# Altium project Battery Monitor V2.PrjPcb
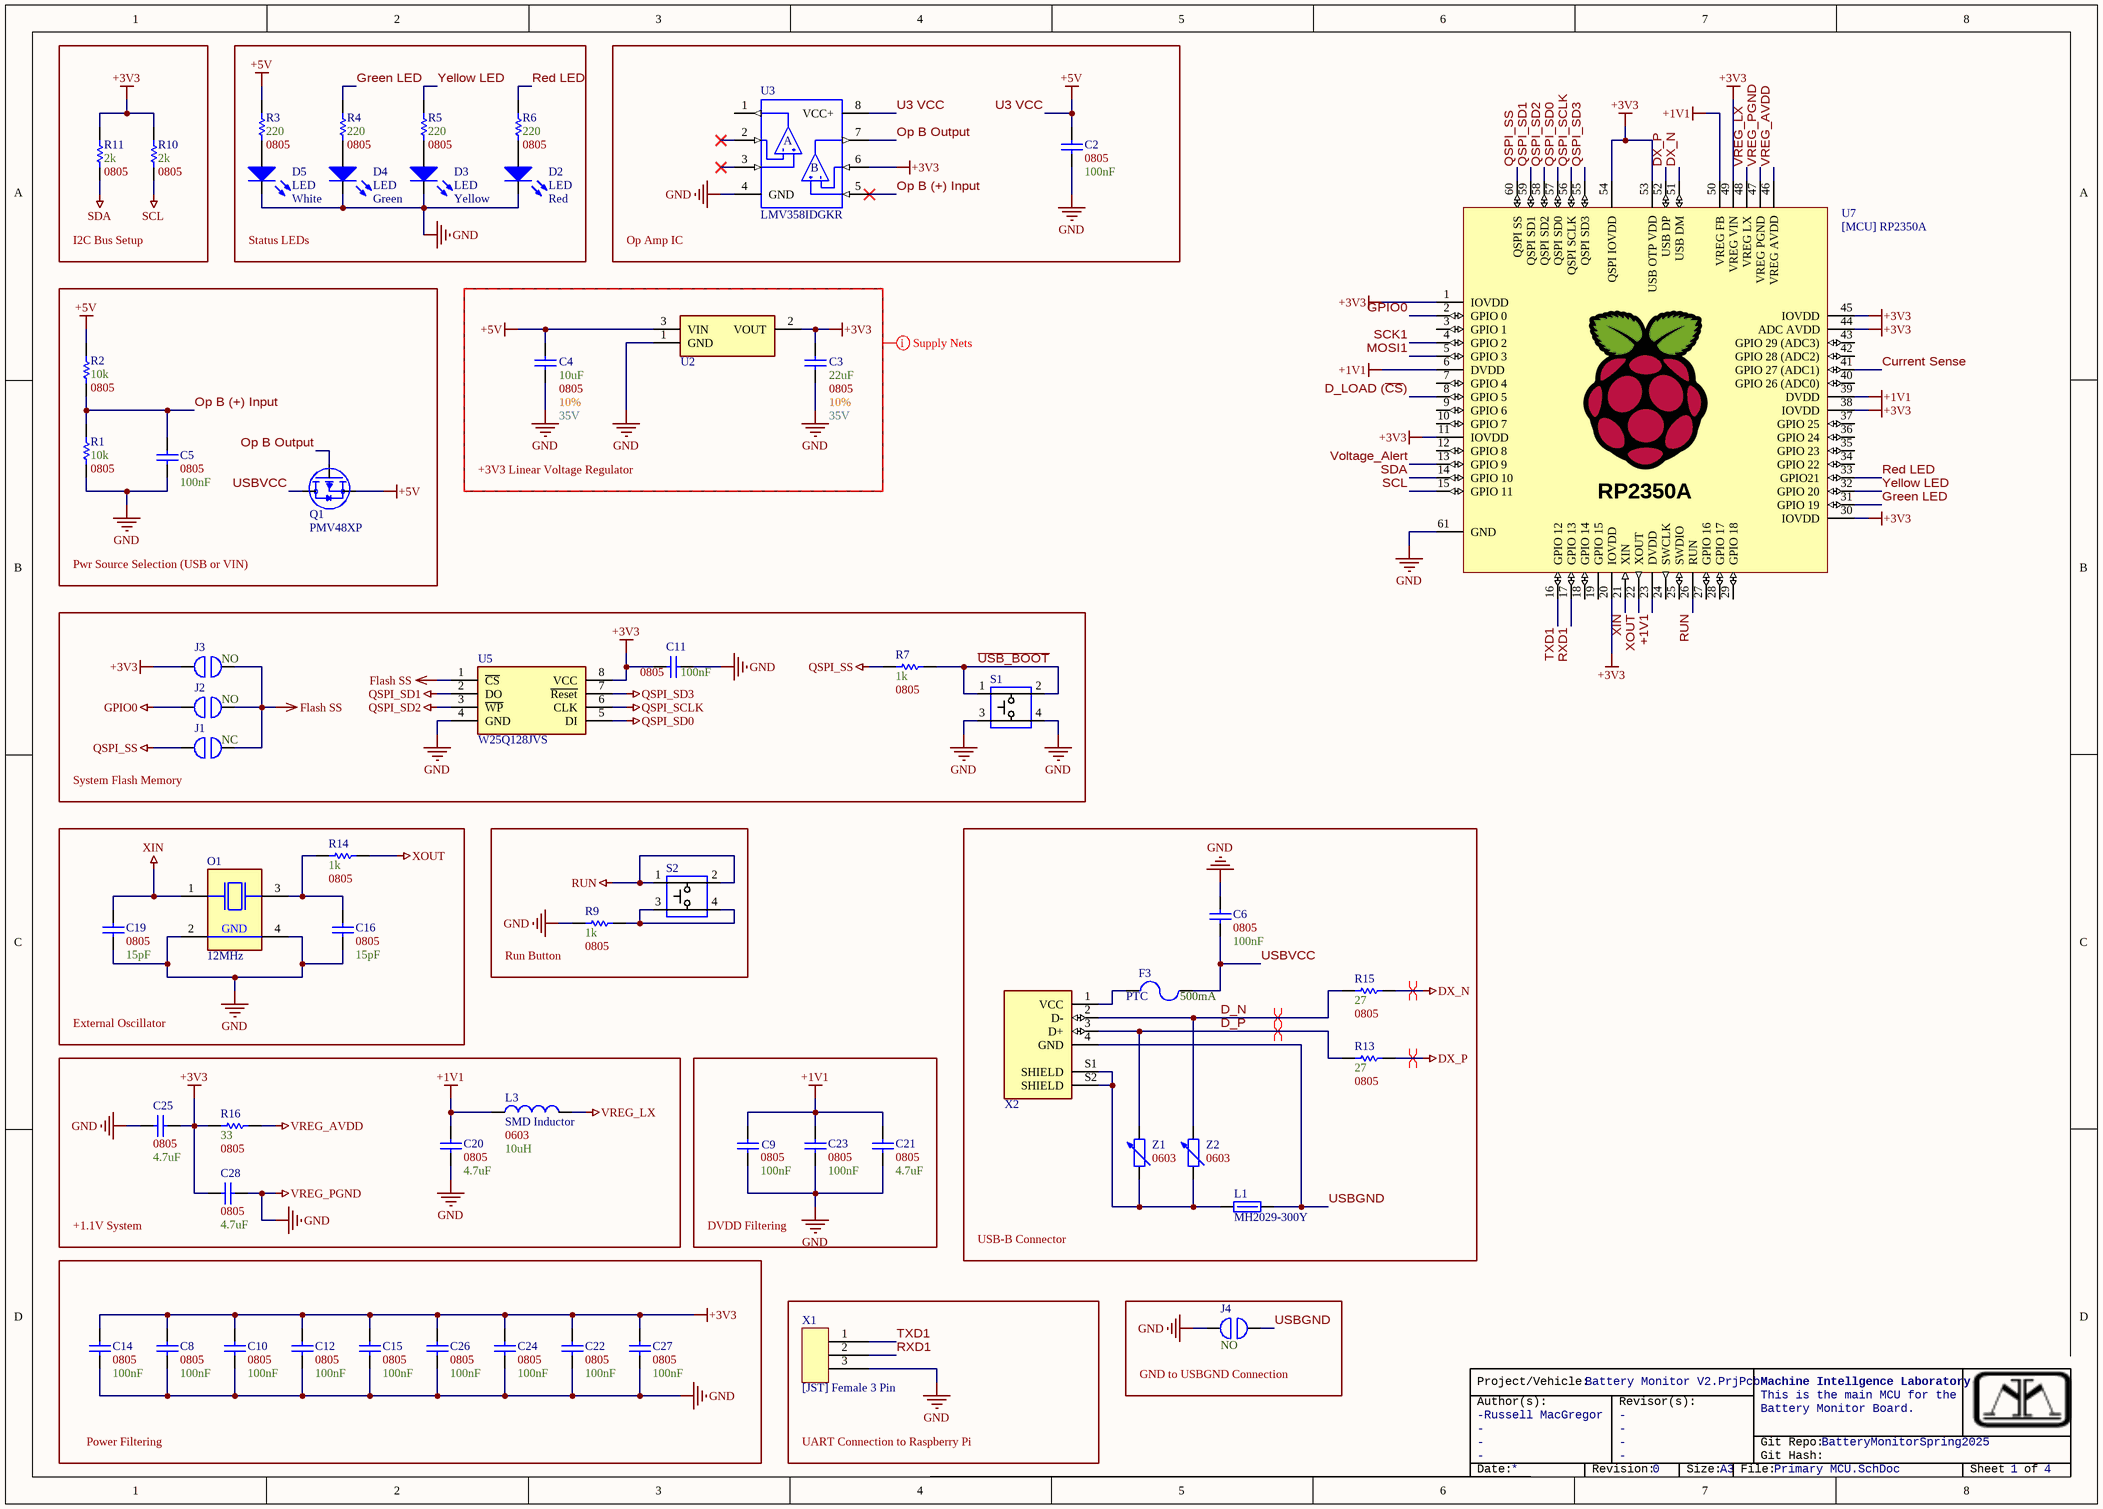
[diagram p0: Primary MCU.SchDoc]
4 sheets, 87 parts. Net scope: global (net labels, ports and power ports of the same name join across sheets).
Board file: main.PcbDoc
Sheets:
  Primary MCU.SchDoc
  Battery Monitoring.SchDoc
  Seven-Seg Displays.SchDoc
  DC Step-Down Converter.SchDoc

## Sheet Primary MCU.SchDoc
size A3; ENG_APP_DATE: --/--/--; DSN_APP_DATE: --/--/--; CHK_APP_DATE: --/--/--; Sheet_Number: 1; Author1: Russell MacGregor; VersionControl_Repository: BatteryMonitorSpring2025; Date: 03/09/2025; Organization: Machine Intellgence Laboratory; Des1: This is the main MCU for the; Des2: Battery Monitor Board.; Revision: 0; SheetNumber: 1; SheetTotal: 4; Time: 12:13 AM

### Parts
C2  Size Package: 0805  Capacitance: 100nF  [[Cap] SMD 0805]  (hidden comment: [Cap] SMD Nonpolarized)
C3  Voltage: 35V  Tolerance: 10%  Size Package: 0805  Capacitance: 22uF  [[Cap] SMD 0805]  (hidden comment: SMD Nonpolarized)
C4  Voltage: 35V  Tolerance: 10%  Size Package: 0805  Capacitance: 10uF  [[Cap] SMD 0805]  (hidden comment: SMD Nonpolarized)
C5  Size Package: 0805  Capacitance: 100nF  [[Cap] SMD 0805]  (hidden comment: [Cap] SMD Nonpolarized)
C6  Size Package: 0805  Capacitance: 100nF  [[Cap] SMD 0805]  (hidden comment: [Cap] SMD Nonpolarized)
C8  Size Package: 0805  Capacitance: 100nF  [[Cap] SMD 0805]  (hidden comment: [Cap] SMD Nonpolarized)
C9  Size Package: 0805  Capacitance: 100nF  [[Cap] SMD 0805]  (hidden comment: [Cap] SMD Nonpolarized)
C10  Size Package: 0805  Capacitance: 100nF  [[Cap] SMD 0805]  (hidden comment: [Cap] SMD Nonpolarized)
C11  Size Package: 0805  Capacitance: 100nF  [[Cap] SMD 0805]  (hidden comment: [Cap] SMD Nonpolarized)
C12  Size Package: 0805  Capacitance: 100nF  [[Cap] SMD 0805]  (hidden comment: [Cap] SMD Nonpolarized)
C14  Size Package: 0805  Capacitance: 100nF  [[Cap] SMD 0805]  (hidden comment: [Cap] SMD Nonpolarized)
C15  Size Package: 0805  Capacitance: 100nF  [[Cap] SMD 0805]  (hidden comment: [Cap] SMD Nonpolarized)
C16  Size Package: 0805  Capacitance: 15pF  [[Cap] SMD 0805]  (hidden comment: [Cap] SMD Nonpolarized)
C19  Size Package: 0805  Capacitance: 15pF  [[Cap] SMD 0805]  (hidden comment: [Cap] SMD Nonpolarized)
C20  Size Package: 0805  Capacitance: 4.7uF  [[Cap] SMD 0805]  (hidden comment: [Cap] SMD Nonpolarized)
C21  Size Package: 0805  Capacitance: 4.7uF  [[Cap] SMD 0805]  (hidden comment: [Cap] SMD Nonpolarized)
C22  Size Package: 0805  Capacitance: 100nF  [[Cap] SMD 0805]  (hidden comment: [Cap] SMD Nonpolarized)
C23  Size Package: 0805  Capacitance: 100nF  [[Cap] SMD 0805]  (hidden comment: [Cap] SMD Nonpolarized)
C24  Size Package: 0805  Capacitance: 100nF  [[Cap] SMD 0805]  (hidden comment: [Cap] SMD Nonpolarized)
C25  Size Package: 0805  Capacitance: 4.7uF  [[Cap] SMD 0805]  (hidden comment: [Cap] SMD Nonpolarized)
C26  Size Package: 0805  Capacitance: 100nF  [[Cap] SMD 0805]  (hidden comment: [Cap] SMD Nonpolarized)
C27  Size Package: 0805  Capacitance: 100nF  [[Cap] SMD 0805]  (hidden comment: [Cap] SMD Nonpolarized)
C28  Size Package: 0805  Capacitance: 4.7uF  [[Cap] SMD 0805]  (hidden comment: [Cap] SMD Nonpolarized)
D2  LED  Color: Red  [[LED] Thru-Hole, 3mm, Red]
D3  LED  Color: Yellow  [[LED] Thru-Hole, 3mm, Yellow]
D4  LED  Color: Green  [[LED] Thru-Hole, 3mm, Green]
D5  LED  Color: White  [[LED] Thru-Hole, 3mm, White]
F3  PTC  Trip Current: 500mA  [[PTC] 500mA Trip]
J1  NO/NC: NC  [[Jumper] Solderable Jumper]  (hidden comment: [Jump] SMD Jumper)
J2  NO/NC: NO  [[Jumper] Solderable Jumper]  (hidden comment: [Jump] SMD Jumper)
J3  NO/NC: NO  [[Jumper] Solderable Jumper]  (hidden comment: [Jump] SMD Jumper)
J4  NO/NC: NO  [[Jumper] Solderable Jumper]  (hidden comment: [Jump] SMD Jumper)
L1  MH2029-300Y  [[Ferrite] SMD Bead 0805 (1)]
L3  SMD Inductor  Size Package: 0603  Inductance: 10uH  [[Inductor] SMD 0603]
O1  12MHz  [[XTAL] SMD 12MHz]
Q1  PMV48XP  [[FET] P-Channel Mosfet]
R1  Resistance: 10k  Size Package: 0805  [[Res] SMD 0805]  (hidden comment: [Res] SMD Resistor)
R2  Resistance: 10k  Size Package: 0805  [[Res] SMD 0805]  (hidden comment: [Res] SMD Resistor)
R3  Resistance: 220  Size Package: 0805  [[Res] SMD 0805]  (hidden comment: [Res] SMD Resistor)
R4  Resistance: 220  Size Package: 0805  [[Res] SMD 0805]  (hidden comment: [Res] SMD Resistor)
R5  Resistance: 220  Size Package: 0805  [[Res] SMD 0805]  (hidden comment: [Res] SMD Resistor)
R6  Resistance: 220  Size Package: 0805  [[Res] SMD 0805]  (hidden comment: [Res] SMD Resistor)
R7  Resistance: 1k  Size Package: 0805  [[Res] SMD 0805]  (hidden comment: [Res] SMD Resistor)
R9  Resistance: 1k  Size Package: 0805  [[Res] SMD 0805]  (hidden comment: [Res] SMD Resistor)
R10  Resistance: 2k  Size Package: 0805  [[Res] SMD 0805]  (hidden comment: [Res] SMD Resistor)
R11  Resistance: 2k  Size Package: 0805  [[Res] SMD 0805]  (hidden comment: [Res] SMD Resistor)
R13  Resistance: 27  Size Package: 0805  [[Res] SMD 0805]  (hidden comment: [Res] SMD Resistor)
R14  Resistance: 1k  Size Package: 0805  [[Res] SMD 0805]  (hidden comment: [Res] SMD Resistor)
R15  Resistance: 27  Size Package: 0805  [[Res] SMD 0805]  (hidden comment: [Res] SMD Resistor)
R16  Resistance: 33  Size Package: 0805  [[Res] SMD 0805]  (hidden comment: [Res] SMD Resistor)
S1  Standard pushbutton  [[Switch] Pushbutton]  (value not drawn)
S2  Standard pushbutton  [[Switch] Pushbutton]  (value not drawn)
U2  3V3 1A  [[Reg] 3V3 Regulator (2)]  (value not drawn)
U3  LMV358IDGKR  [[IC] Dual Op-Ap]
U5  W25Q128JVS  [[IC] 16Mb Flash Memory]
U7  [MCU] RP2350A  [[MCU] RP2350A]
X1  [JST] Female 3 Pin  [[JST] 3PIN]
X2  [Port] USB Type-B Female (Thru-Hole)  [[Port] USB Type-B Thru-Hole]  (value not drawn)
Z1  Size Package: 0603  [[Inductor] SMD Varistor 0603]  (hidden comment: [Inductor] SMD Varistor)
Z2  Size Package: 0603  [[Inductor] SMD Varistor 0603]  (hidden comment: [Inductor] SMD Varistor)

### Blocks framed on the sheet
I2C Bus Setup: R10 R11
Status LEDs: D2-D5 R3-R6
Op Amp IC: C2 U3
Pwr Source Selection (USB or VIN): C5 Q1 R1 R2
+3V3 Linear Voltage Regulator: C3 C4 U2
System Flash Memory: C11 J1-J3 R7 S1 U5
External Oscillator: C16 C19 O1 R14
Run Button: R9 S2
USB-B Connector: C6 F3 L1 R13 R15 X2 Z1 Z2
+1.1V System: C20 C25 C28 L3 R16
DVDD Filtering: C9 C21 C23
Power Filtering: C8 C10 C12 C14 C15 C22 C24 C26 C27
UART Connection to Raspberry Pi: X1
GND to USBGND Connection: J4

### Nets
+1V1: C9.2 C20.2 C21.2 C23.2 L3.1 U7.6(DVDD) U7.23(DVDD) U7.39(DVDD) U7.50(VREG_FB)
+3V3: C3.2 C8.2 C10.2 C11.2 C12.2 C14.2 C15.2 C22.2 C24.2 C25.1 C26.2 C27.2 C28.2 J3.1 R10.2 R11.2 R16.2 U2.2(VOUT) U3.6(2IN-) U5.8(VCC) U7.1(IOVDD) U7.11(IOVDD) U7.20(IOVDD) U7.30(IOVDD) U7.38(IOVDD) U7.44(ADC_AVDD) U7.45(IOVDD) U7.49(VREG_VIN) U7.53(USB_OTP_VDD) U7.54(QSPI_IOVDD)
+5V: C2.2 C4.2 Q1.2(S) R2.2 R3.1 U2.3(VIN) U3.8(VCC+)  [also labelled U3 VCC]
Current Sense: U7.41(GPIO_27_(ADC1))
D_LOAD (~{CS}): U7.8(GPIO_5)
DX_N: R15.1 U7.51(USB_DM)
DX_P: R13.1 U7.52(USB_DP)
Flash SS: J1.2 J2.2 J3.2 U5.1(~{CS})
GND: C2.1 C3.1 C4.1 C5.1 C6.2 C8.1 C9.1 C10.1 C11.1 C12.1 C14.1 C15.1 C16.1 C19.1 C20.1 C21.1 C22.1 C23.1 C24.1 C25.2 C26.1 C27.1 C28.1 D2.2(K) D3.2(K) D4.2(K) D5.2(K) J4.1 O1.2(GND) O1.4(GND) R1.1 R9.2 S1.3 S1.4 U2.1(GND) U3.4(GND) U5.4(GND) U7.47(VREG_PGND) U7.61(GND) X1.3  [also labelled VREG_PGND]
GPIO0: J2.1 U7.2(GPIO_0)
MOSI1: U7.5(GPIO_3)
QSPI_SCLK: U5.6(CLK) U7.56(QSPI_SCLK)
QSPI_SD0: U5.5(DI) U7.57(QSPI_SD0)
QSPI_SD1: U5.2(DO) U7.59(QSPI_SD1)
QSPI_SD2: U5.3(~{WP}) U7.58(QSPI_SD2)
QSPI_SD3: U5.7(~{Reset}) U7.55(QSPI_SD3)
QSPI_SS: J1.1 R7.2 U7.60(QSPI_SS)
RUN: S2.1 S2.2 U7.26(RUN)
SCK1: U7.4(GPIO_2)
SCL: R10.1 U7.15(GPIO_11)
SDA: R11.1 U7.14(GPIO_10)
Voltage_Alert: U7.13(GPIO_9)
VREG_AVDD: R16.1 U7.46(VREG_AVDD)
VREG_LX: L3.2 U7.48(VREG_LX)
XIN: C19.2 O1.1(XTAL1) U7.21(XIN)
XOUT: R14.1 U7.22(XOUT)
D_N: R15.2 X2.2(D-) Z2.2
D_P: R13.2 X2.3(D+) Z1.2
Green LED: R4.1 U7.31(GPIO_19)
Op B (+) Input: C5.2 R1.2 R2.1 U3.5(2IN+)
Op B Output: Q1.1(G) U3.7(2OUT)
Red LED: R6.1 U7.33(GPIO21)
RXD1: U7.17(GPIO_13) X1.2
TXD1: U7.16(GPIO_12) X1.1
~{USB_BOOT}: R7.1 S1.1 S1.2
USBGND: J4.2 L1.2 X2.4(GND)
USBVCC: C6.1 F3.2 Q1.3(D)
Yellow LED: R5.1 U7.32(GPIO_20)
NetC16_2: C16.2 O1.3(XTAL2) R14.2
NetD2_1: D2.1(A) R6.2
NetD3_1: D3.1(A) R5.2
NetD4_1: D4.1(A) R4.2
NetD5_1: D5.1(A) R3.2
NetF3_1: F3.1 X2.1(VCC)
NetL1_1: L1.1 X2.S1(SHIELD) X2.S2(SHIELD) Z1.1 Z2.1
NetR9_1: R9.1 S2.3 S2.4

Not connected (* = marked no-connect by the designer): U3 1(1OUT) 2(1IN-)* 3(1IN+)*; U7 3(GPIO_1) 7(GPIO_4) 9(GPIO_6) 10(GPIO_7) 12(GPIO_8) 18(GPIO_14) 19(GPIO_15) 24(SWCLK) 25(SWDIO) 27(GPIO_16) 28(GPIO_17) 29(GPIO_18) 34(GPIO_22) 35(GPIO_23) 36(GPIO_24) 37(GPIO_25) 40(GPIO_26_(ADC0)) 42(GPIO_28_(ADC2)) 43(GPIO_29_(ADC3))

### Layout directives
differential pair; differential pair class USB_Pairs: D_N, D_P, DX_N, DX_P
net class Supply_Nets: +3V3, +5V, GND

### Notes on the sheet
- Project/Vehicle:
- Author(s):
- -
- Revisor(s):
- Git Repo:
- Git Hash:
- Date:
- Revision:
- Size:
- A3
- File:
- Sheet
- of
- (in symbol [IC] Dual Op-Amp) A; B
- (in symbol [MCU] RP2350A) RP2350A

### Library data of the parts
C3 C4 = [Cap] SMD Nonpolarized
D2-D5 = [LED] Thru-Hole 3mm: 3mm LED
F3 = [PTC] 500mA Trip: MF-MSMF050-2 / JLC Part #: C17313; JLC Part #: C17313; Size Package: 1812
J1-J4 = [Jump] SMD Jumper: Solderable jumper
L1 = [Ferrite] SMD Ferrite Bead (1): 652-MH2029-300Y; Res @ Freq: 30 @ 100MHz; Size Package: 0805
L3 = [Inductor] SMD Inductor: JLC Part #: *; Mouser Part #: *
O1 = [XTAL] SMD 12MHz: 815-ABM8-272-T3
Q1 = [FET] P-Channel MOSFET: JLC Part #: C2959854
S1 S2 = [Switch] Pushbutton
U2 = [Reg] 3V3 Regulator (2): AZ1117CH-3.3TRG1; Supplier 1: DigiKey; Supplier Part Number 1: AZ1117CH-3.3TRG1DICT-ND
U3 = [IC] Dual Op-Amp: JLC Part #: C105242
U5 = [IC] 16Mb Flash Memory: W25Q128JVSIQ TR
X2 = [Port] USB Type-B Female (Thru-Hole): USB-B-S-F-B-TH; JLC Part #: C5714571
C2 C5 C6 C8-C12 C14-C16 C19-C28 = [Cap] SMD Nonpolarized: JLC Part #: *; Mouser Part #: *
Z1 Z2 = [Inductor] SMD Varistor: JLC Part #: C840634

## Sheet Battery Monitoring.SchDoc
size A4; Author1: Russell MacGregor; VersionControl_Repository: BatteryMonitorSpring2025; Organization: Machine Intellgence Laboratory; Des1: This IC monitors the voltage; Des2: of the battery and the current; Des3: drawn from it.; SheetNumber: 2; SheetTotal: 4
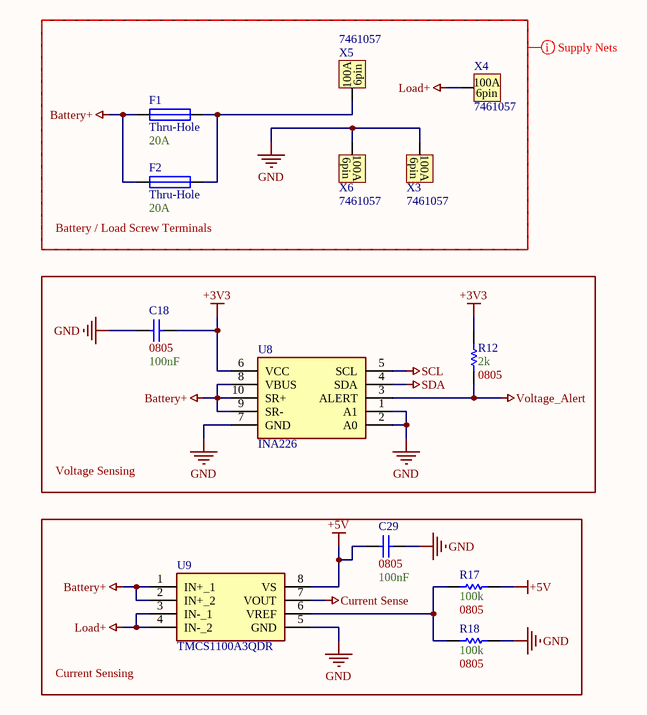
[diagram p1: Battery Monitoring.SchDoc]

### Parts
C18  Size Package: 0805  Capacitance: 100nF  [[Cap] SMD 0805]  (hidden comment: [Cap] SMD Nonpolarized)
C29  Size Package: 0805  Capacitance: 100nF  [[Cap] SMD 0805]  (hidden comment: [Cap] SMD Nonpolarized)
F1  Thru-Hole  Capacity: 20A  [[Fuse] Blade (2)]
F2  Thru-Hole  Capacity: 20A  [[Fuse] Blade (2)]
R12  Resistance: 2k  Size Package: 0805  [[Res] SMD 0805]  (hidden comment: [Res] SMD Resistor)
R17  Resistance: 100k  Size Package: 0805  [[Res] SMD 0805]  (hidden comment: [Res] SMD Resistor)
R18  Resistance: 100k  Size Package: 0805  [[Res] SMD 0805]  (hidden comment: [Res] SMD Resistor)
U8  INA226  [[IC] Battery Voltage Monitor (36V)]
U9  TMCS1100A3QDR  [[IC] Hall Effect Current Sensor]
X3  7461057  [[Port] Shank Connector (100A)]
X4  7461057  [[Port] Shank Connector (100A)]
X5  7461057  [[Port] Shank Connector (100A)]
X6  7461057  [[Port] Shank Connector (100A)]

### Blocks framed on the sheet
Battery / Load Screw Terminals: F1 F2 X3-X6
Voltage Sensing: C18 R12 U8
Current Sensing: C29 R17 R18 U9

### Nets
+3V3: C18.1 R12.2 U8.6(VCC)
+5V: C29.2 R17.2 U9.8(VS)
Battery+: F1.1 F2.1 U8.8(VBUS) U8.9(SR-) U8.10(SR+) U9.1(IN+_1) U9.2(IN+_2)
Current Sense: U9.7(VOUT)
GND: C18.2 C29.1 R18.1 U8.1(A1) U8.2(A0) U8.7(GND) U9.5(GND) X3.1 X6.1
Load+: U9.3(IN-_1) U9.4(IN-_2) X4.1
SCL: U8.5(SCL)
SDA: U8.4(SDA)
Voltage_Alert: R12.1 U8.3(ALERT)
NetF1_2: F1.2 F2.2 X5.1
NetR17_1: R17.1 R18.2 U9.6(VREF)

### Layout directives
net class Supply_Nets: Battery+, GND, Load+

### Notes on the sheet
- Project/Vehicle:
- Author(s):
- -
- Revisor(s):
- Git Repo:
- Git Hash:
- Date:
- Revision:
- Size:
- A4
- File:
- Sheet
- of
- (in symbol [Port] Shank Connector (100A)) 100A; 6pin

### Library data of the parts
F1 F2 = [Fuse] Thru-Hole Blade: Mouser Part #: *
U8 = [IC] Battery Voltage Monitor (36V): INA226AIDGST
U9 = [IC] Hall Effect Current Sensor: TMCS1100
X3-X6 = [Port] Shank Connector (100A): 7461057, internal thread
C18 C29 = [Cap] SMD Nonpolarized: JLC Part #: *; Mouser Part #: *

## Sheet Seven-Seg Displays.SchDoc
size A4; Organization: Machine Intellgence Laboratory; Des1: This board uses a 4-digit; Des2: seven-segment display to show; Des3: battery voltage & current draw.; SheetNumber: 3; SheetTotal: 4; Author1: Russell MacGregor; VersionControl_Repository: BatteryMonitorSpring2025
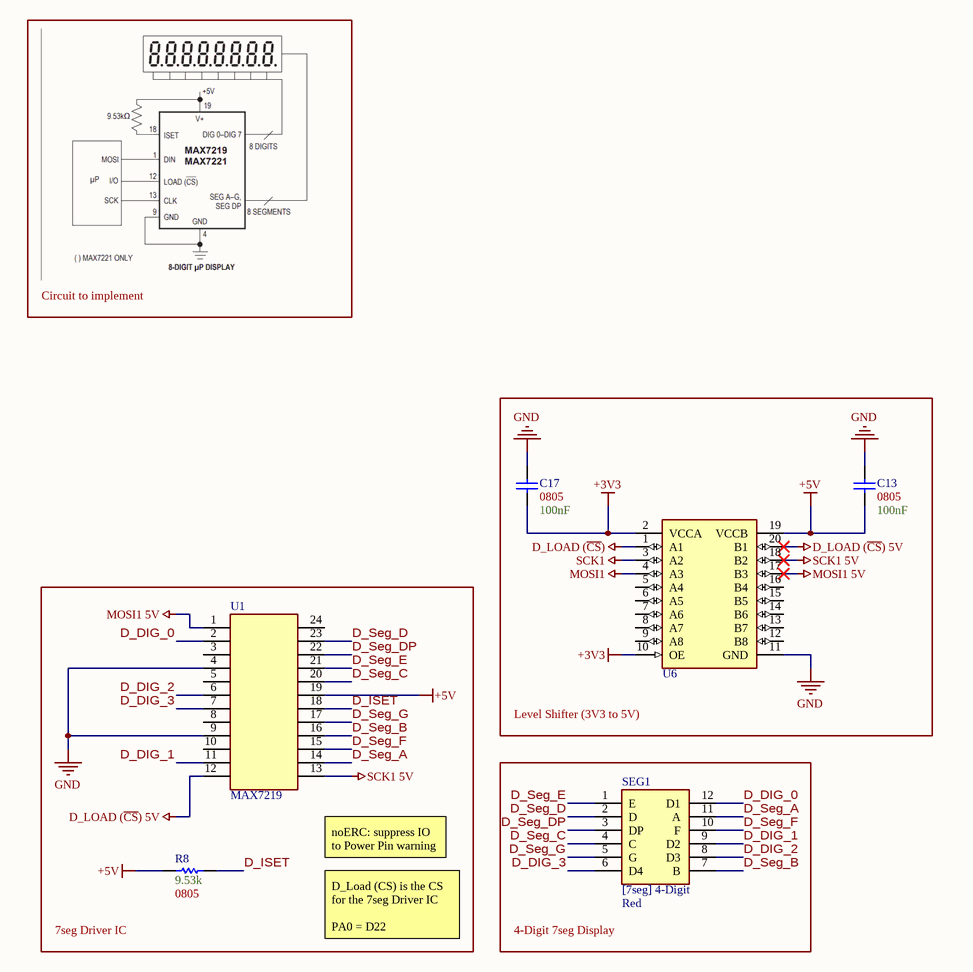
[diagram p2: Seven-Seg Displays.SchDoc]

### Parts
C13  Size Package: 0805  Capacitance: 100nF  [[Cap] SMD 0805]  (hidden comment: [Cap] SMD Nonpolarized)
C17  Size Package: 0805  Capacitance: 100nF  [[Cap] SMD 0805]  (hidden comment: [Cap] SMD Nonpolarized)
R8  Resistance: 9.53k  Size Package: 0805  [[Res] SMD 0805]  (hidden comment: [Res] SMD Resistor)
SEG1  [7seg] 4-Digit  Color: Red  [[7seg] 4-Digit]
U1  MAX7219  [[DIP IC] 24pin, Socket]
U6  [IC] Level Shifter (2)  [[IC] Level Shifter (2)]  (value not drawn)

### Blocks framed on the sheet
Level Shifter (3V3 to 5V): C13 C17 U6
7seg Driver IC: R8 U1
4-Digit 7seg Display: SEG1

### Nets
+3V3: C17.1 U6.2(VCCA) U6.10(OE)
+5V: C13.1 R8.1 U1.19 U6.19(VCCB)
D_LOAD (~{CS}): U6.1(A1)
D_LOAD (~{CS}) 5V: U1.12 U6.20(B1)
GND: C13.2 C17.2 U1.4 U1.9 U6.11(GND)
MOSI1: U6.4(A3)
MOSI1 5V: U1.1 U6.17(B3)
SCK1: U6.3(A2)
SCK1 5V: U1.13 U6.18(B2)
D_DIG_0: SEG1.12(D1) U1.2
D_DIG_1: SEG1.9(D2) U1.11
D_DIG_2: SEG1.8(D3) U1.6
D_DIG_3: SEG1.6(D4) U1.7
D_ISET: R8.2 U1.18
D_Seg_A: SEG1.11(A) U1.14
D_Seg_B: SEG1.7(B) U1.16
D_Seg_C: SEG1.4(C) U1.20
D_Seg_D: SEG1.2(D) U1.23
D_Seg_DP: SEG1.3(DP) U1.22
D_Seg_E: SEG1.1(E) U1.21
D_Seg_F: SEG1.10(F) U1.15
D_Seg_G: SEG1.5(G) U1.17

Not connected (* = marked no-connect by the designer): U1 3 5 8 10 24; U6 5(A4) 6(A5) 7(A6) 8(A7) 9(A8) 12(B8) 13(B7) 14(B6) 15(B5) 16(B4)

### Notes on the sheet
- Circuit to implement
- (near U1) noERC: suppress IO to Power Pin warning
- D_Load (CS) is the CS for the 7seg Driver IC
  PA0 = D22
- Project/Vehicle:
- Author(s):
- -
- Revisor(s):
- Git Repo:
- Git Hash:
- Date:
- Revision:
- Size:
- A4
- File:
- Sheet
- of

### Library data of the parts
U1 = [DIP IC] 24pin: Mouser Part #: *
U6 = [IC] Level Shifter (2): TXS0108EQPWRQ1; Supplier 1: DigiKey; Supplier Part Number 1: 296-42401-1-ND
C13 C17 = [Cap] SMD Nonpolarized: JLC Part #: *; Mouser Part #: *
SEG1 = [7seg] 4-Digit: Mouser Part #: 474-COM-11405

## Sheet DC Step-Down Converter.SchDoc
size A4; Organization: Machine Intelligence Laboratory; SheetNumber: 4; SheetTotal: 4; Des1: This steps down the ~22V; Des2: from the battery to 5V for use; Des3: with PCB electronics.; Author1: Russell MacGregor; VersionControl_Repository: BatteryMonitorSpring2025
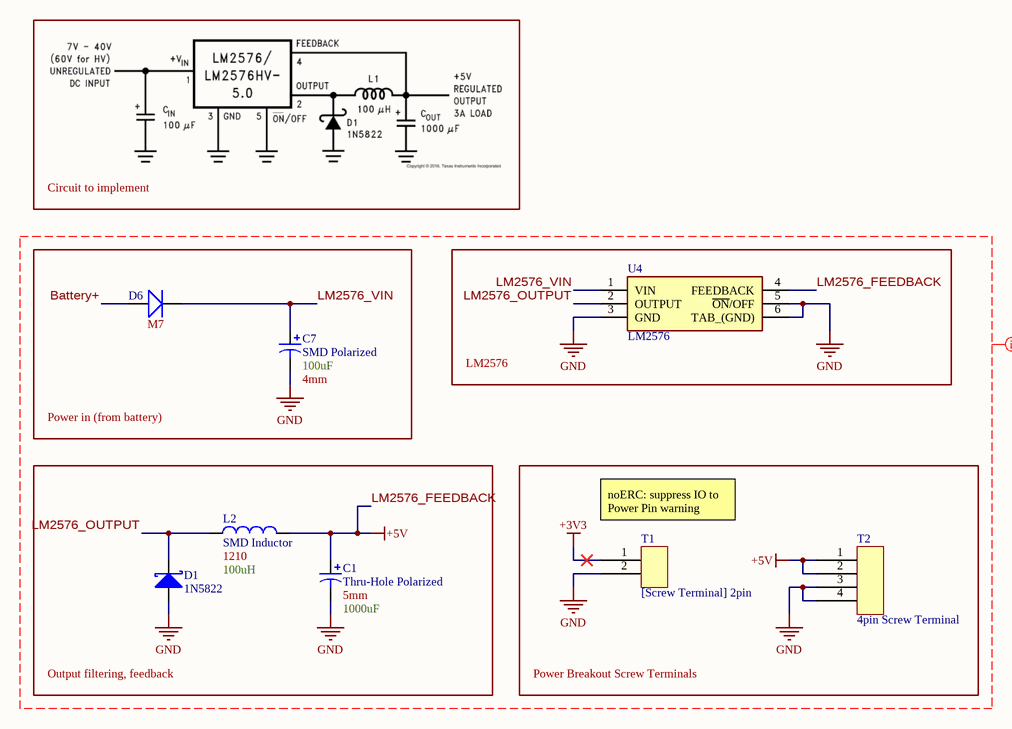
[diagram p3: DC Step-Down Converter.SchDoc]

### Parts
C1  Thru-Hole Polarized  Pin Spacing: 5mm  Capacitance: 1000uF  [[Cap] Thru-Hole Polarized 5mm]
C7  SMD Polarized  Capacitance: 100uF  Diameter: 4mm  [[Cap] SMD Polarized, 4mm]
D1  1N5822  [[Diode] Thru-Hole Schottky]
D6  Size Package: M7  [[Diode] SMD M7]  (hidden comment: Rectifier)
L2  SMD Inductor  Size Package: 1210  Inductance: 100uH  [[Inductor] SMD 1210]
T1  [Screw Terminal] 2pin  [[Screw Terminal] 2pin]
T2  4pin Screw Terminal  [[Screw Terminal] 4pin]
U4  LM2576  [[IC] Buck Converter]

### Blocks framed on the sheet
Power in (from battery): C7 D6
LM2576: U4
Output filtering, feedback: C1 D1 L2
Power Breakout Screw Terminals: T1 T2

### Nets
+3V3: T1.1
+5V: C1.1 L2.2 T2.1 T2.2 U4.4(FEEDBACK)  [also labelled LM2576_FEEDBACK]
Battery+: D6.2(Anode)
GND: C1.2 C7.2 D1.2(A) T1.2 T2.3 T2.4 U4.3(GND) U4.5(~{ON}/OFF) U4.6(TAB_(GND))
LM2576_OUTPUT: D1.1(K) L2.1 U4.2(OUTPUT)
LM2576_VIN: C7.1 D6.1(Cathode) U4.1(VIN)

### Layout directives
net class Supply_Nets: +3V3, +5V, Battery+, GND, LM2576_FEEDBACK, LM2576_OUTPUT, LM2576_VIN

### Notes on the sheet
- Circuit to implement
- (near T1) noERC: suppress IO to Power Pin warning
- Project/Vehicle:
- Author(s):
- -
- Revisor(s):
- Git Repo:
- Git Hash:
- Date:
- Revision:
- Size:
- A4
- File:
- Sheet
- of

### Library data of the parts
C1 = [Cap] Thru-Hole Polarized: JLC Part #: *; Mouser Part #: *
C7 = [Cap] SMD Polarized: JLC Part #: *; Mouser Part #: *
D1 = [Diode] Thru-Hole Schottky: Mouser Part #: 511-1N5822
D6 = [Diode] SMD Rectifier: Generic; Mouser Part #: *
L2 = [Inductor] SMD Inductor: JLC Part #: *; Mouser Part #: *
T2 = [Screw Terminal] 4pin
U4 = [IC] Buck Converter

## Nets that join several sheets
+3V3: Primary MCU (30 pins), Battery Monitoring (C18.1 R12.2 U8.6), Seven-Seg Displays (C17.1 U6.2 U6.10), DC Step-Down Converter (T1.1)
+5V: Primary MCU (7 pins), Battery Monitoring (C29.2 R17.2 U9.8), Seven-Seg Displays (C13.1 R8.1 U1.19 U6.19), DC Step-Down Converter (5 pins)
Battery+: Battery Monitoring (7 pins), DC Step-Down Converter (D6.2)
Current Sense: Primary MCU (U7.41), Battery Monitoring (U9.7)
D_LOAD (~{CS}): Primary MCU (U7.8), Seven-Seg Displays (U6.1)
GND: Primary MCU (40 pins), Battery Monitoring (9 pins), Seven-Seg Displays (5 pins), DC Step-Down Converter (9 pins)
MOSI1: Primary MCU (U7.5), Seven-Seg Displays (U6.4)
SCK1: Primary MCU (U7.4), Seven-Seg Displays (U6.3)
SCL: Primary MCU (R10.1 U7.15), Battery Monitoring (U8.5)
SDA: Primary MCU (R11.1 U7.14), Battery Monitoring (U8.4)
Voltage_Alert: Primary MCU (U7.13), Battery Monitoring (R12.1 U8.3)